# EAGLE design DOMINGO_FERMENTER_BOARD (EAGLE 9.7.0)
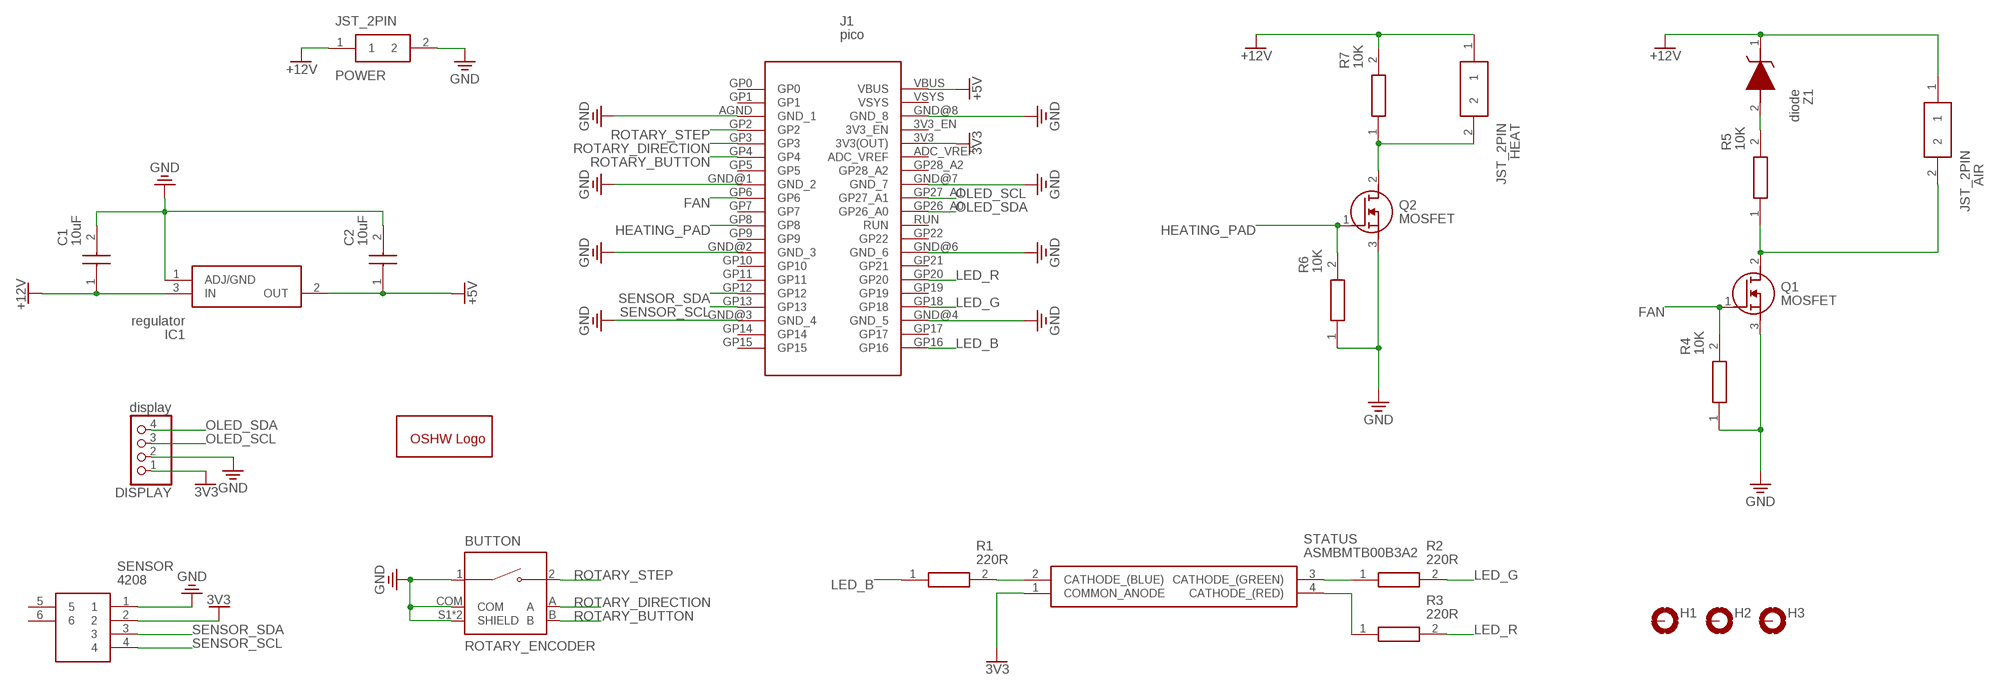
[diagram p0: schematic, sheet 1]

## Parts
AIR  JST_2PIN  [1769]
BUTTON  ROTARY_ENCODER  [XDCR_PEC11R-4215F-S0024]
C1  10uF  CAP_10UF  [CAPC2114X145N]
C2  10uF  CAP_10UF  [CAPC2114X145N]
DISPLAY  display  OLED_DISPLAY_1_3  [1X04-OLED_I2C]
GOLD_ORB_SM1  OSHWLOGOLOGO5MM  [OSHW_5MM]
H1  MOUNT-PAD-ROUND3.2  [3,2-PAD]
H2  MOUNT-PAD-ROUND3.2  [3,2-PAD]
H3  MOUNT-PAD-ROUND3.2  [3,2-PAD]
HEAT  JST_2PIN  [1769]
IC1  regulator  VOLT_REG  [LM317MADTRKG]
J1  pico  PICOPICO-TH-CLEAN  [RPI_PICO_TH]
POWER  JST_2PIN  [1769]
Q1  MOSFET  [FFSD0465A]
Q2  MOSFET  [FFSD0465A]
R1  220R  RES_1206  [RESC3116X65N]
R2  220R  RES_1206  [RESC3116X65N]
R3  220R  RES_1206  [RESC3116X65N]
R4  10K  RES_1206  [RESC3116X65N]
R5  10K  RES_1206  [RESC3116X65N]
R6  10K  RES_1206  [RESC3116X65N]
R7  10K  RES_1206  [RESC3116X65N]
SENSOR  4208  [4208]
STATUS  ASMBMTB00B3A2  LED_RGB  [ASMBMTB00B3A2]
Z1  diode  DIODE  [SOD3716X135N]

## Nets
3V3 [signal]: DISPLAY.1(VDD) J1.3V3(3V3(OUT)) SENSOR.2 STATUS.1(COMMON_ANODE)
+5V [POWER]: C2.1 IC1.2(OUT) J1.VBUS
+12V [POWER]: AIR.1 C1.1 HEAT.1 IC1.3(IN) POWER.1 R7.2 Z1.1(K)
FAN [POWER]: J1.GP6 Q1.1(G) R4.2
GND: BUTTON.1 BUTTON.COM BUTTON.S1(SHIELD) BUTTON.S2(SHIELD) C1.2 C2.2 DISPLAY.2(GND) IC1.1(ADJ/GND) J1.AGND(GND_1) J1.GND@1(GND_2) J1.GND@2(GND_3) J1.GND@3(GND_4) J1.GND@4(GND_5) J1.GND@6(GND_6) J1.GND@7(GND_7) J1.GND@8(GND_8) POWER.2 Q1.3(S) Q2.3(S) R4.1 R6.1 SENSOR.1
HEATING_PAD [POWER]: J1.GP8 Q2.1(G) R6.2
LED_B [signal]: J1.GP16 R1.1
LED_G [signal]: J1.GP18 R2.2
LED_R [signal]: J1.GP20 R3.2
N$1: HEAT.2 Q2.2(D) R7.1
N$2: R1.2 STATUS.2(CATHODE_(BLUE))
N$3: R2.1 STATUS.3(CATHODE_(GREEN))
N$4: R3.1 STATUS.4(CATHODE_(RED))
N$6: AIR.2 Q1.2(D) R5.1
N$7: R5.2 Z1.2(A)
OLED_SCL [signal]: DISPLAY.3(SCK) J1.GP27_A1
OLED_SDA [signal]: DISPLAY.4(SDA) J1.GP26_A0
ROTARY_BUTTON [signal]: BUTTON.B J1.GP4
ROTARY_DIRECTION [signal]: BUTTON.A J1.GP3
ROTARY_STEP [signal]: BUTTON.2 J1.GP2
SENSOR_SCL [signal]: J1.GP13 SENSOR.4
SENSOR_SDA [signal]: J1.GP12 SENSOR.3
Unconnected: H1.B3,2(MOUNT) H2.B3,2(MOUNT) H3.B3,2(MOUNT) J1.3V3_EN J1.ADC_VREF J1.GP0 J1.GP1 J1.GP5 J1.GP7 J1.GP9 J1.GP10 J1.GP11 J1.GP14 J1.GP15 J1.GP17 J1.GP19 J1.GP21 J1.GP22 J1.GP28_A2 J1.RUN J1.VSYS SENSOR.5 SENSOR.6

## Library data of the parts
AIR HEAT POWER = Library Fermenter Mini:JST_2PIN: Adafruit Accessories JST-PH 2-pin SMT Right Angle Connect Source: Datasheet <https://cdn-shop.adafruit.com/datasheets/17311.pdf>; ARROW_PART_NUMBER: 1769; ARROW_PRICE-STOCK: https://www.arrow.com/en/products/1769/adafruit-industries?region=nac; DESCRIPTION: Adafruit Accessories JST-PH 2-pin SMT Right Angle Connect; HEIGHT: mm; MANUFACTURER_NAME: Adafruit; MANUFACTURER_PART_NUMBER: 1769; MOUSER_PART_NUMBER: 485-1769; MOUSER_PRICE-STOCK: https://www.mouser.co.uk/ProductDetail/Adafruit/1769?qs=GURawfaeGuBbgoGtf2XstA%3D%3D
BUTTON = Library Fermenter Mini:ROTARY_ENCODER: Incremental Encoder, 12 Mm, Contact Rating 10 Ma - 5 Vdc Check availability <https://pricing.snapeda.com/parts/PEC11R-4215F-S0024/Bourns/view-part?ref=eda>; AVAILABILITY: In Stock; DESCRIPTION: Rotary Encoder Mechanical 24 Quadrature (Incremental) Vertical; MF: Bourns; MP: PEC11R-4215F-S0024; PACKAGE: None; PRICE: None; PURCHASE-URL: https://pricing.snapeda.com/search/part/PEC11R-4215F-S0024/?ref=eda
C1 C2 = Library Fermenter Mini:CAP_10UF: Multilayer Ceramic Capacitors MLCC - SMD/SMT 0805 10VDC 10uF 10% X7T AEC-Q200 Source: Datasheet <https://www.mouser.de/datasheet/2/396/TAIY_S_A0012830329_1-2514546.pdf>; DESCRIPTION: Multilayer Ceramic Capacitors MLCC - SMD/SMT 0805 10VDC 10uF 10% X7T AEC-Q200; HEIGHT: 1.45mm; MANUFACTURER_NAME: TAIYO YUDEN; MANUFACTURER_PART_NUMBER: LMR212BD7106KG-T; MOUSER_PART_NUMBER: 963-LMR212BD7106KG-T; MOUSER_PRICE-STOCK: https://www.mouser.co.uk/ProductDetail/Taiyo-Yuden/LMR212BD7106KG-T?qs=DRkmTr78QATXuUQGmCCYPQ%3D%3D
DISPLAY = OLED_display_1_3:OLED_DISPLAY_1_3
GOLD_ORB_SM1 = oshw:OSHWLOGO: The OSHW logo for PCB layout
H1-H3 = holes:MOUNT-PAD-ROUND: MOUNTING PAD, round
IC1 = Library Fermenter Mini:VOLT_REG: LDO Voltage Regulators 5.0V 1A Positive Source: Datasheet <https://componentsearchengine.com/Datasheets/2/NCP1117DT50G.pdf>; ARROW_PART_NUMBER: NCP1117DT50G; ARROW_PRICE-STOCK: https://www.arrow.com/en/products/ncp1117dt50g/on-semiconductor?region=europe; DESCRIPTION: LDO Voltage Regulators 5.0V 1A Positive; HEIGHT: 2.38mm; MANUFACTURER_NAME: ON Semiconductor; MANUFACTURER_PART_NUMBER: NCP1117DT50G; MOUSER_PART_NUMBER: 863-NCP1117DT50G; MOUSER_PRICE-STOCK: https://www.mouser.co.uk/ProductDetail/onsemi/NCP1117DT50G?qs=Gev%252BmEvV0iaXyZQB7E2Yhg%3D%3D
J1 = Library Fermenter Mini:PICO: RP2040 microcontroller chip designed by Raspberry Pi in the United Kingdom 2 SPI, 2 I2C, 2 UART, 3 12-bit ADC, 16 controllable PWM channels Source: Datasheet <https://datasheets.raspberrypi.org/pico/pico_datasheet.pdf>
Q1 Q2 = Library Fermenter Mini:MOSFET: N-Channel Logic Level Power MOSFET 50V, 16A, 47m Source: Datasheet <https://www.onsemi.com/pub/Collateral/RFD16N05LSM-D.PDF>; ARROW_PART_NUMBER: RFD16N05LSM9A; ARROW_PRICE-STOCK: https://www.arrow.com/en/products/rfd16n05lsm9a/on-semiconductor; DESCRIPTION: N-Channel Logic Level Power MOSFET 50V, 16A, 47m; HEIGHT: 2.39mm; MANUFACTURER_NAME: ON Semiconductor; MANUFACTURER_PART_NUMBER: RFD16N05LSM9A; MOUSER_PART_NUMBER: 512-RFD16N05LSM9A; MOUSER_PRICE-STOCK: https://www.mouser.com/Search/Refine.aspx?Keyword=512-RFD16N05LSM9A
R1-R7 = Library Fermenter Mini:RES_1206: SMD AEC-Q200 Compliant Thick Film Chip Resistor, Source: Datasheet <https://www.arrow.com/en/products/crgcq1206f10k/te-connectivity>; ARROW_PART_NUMBER: CRGCQ1206F10K; ARROW_PRICE-STOCK: https://www.arrow.com/en/products/crgcq1206f10k/te-connectivity; DESCRIPTION: SMD AEC-Q200 Compliant Thick Film Chip Resistor,; HEIGHT: 0.65mm; MANUFACTURER_NAME: TE Connectivity; MANUFACTURER_PART_NUMBER: CRGCQ1206F10K; MOUSER_PART_NUMBER: 279-CRGCQ1206F10K; MOUSER_PRICE-STOCK: https://www.mouser.co.uk/ProductDetail/TE-Connectivity-Holsworthy/CRGCQ1206F10K?qs=wUXugUrL1qyq3DLCZm2TIg%3D%3D
SENSOR = Library Fermenter Mini:4208: Adafruit Accessories JST SH 4-pin Right Angle Connector (10-pack) - Qwiic Compatible Source: Datasheet <https://cdn-shop.adafruit.com/product-files/4208/4208_Kaweei_C13396_diagram.pdf>; DESCRIPTION: Adafruit Accessories JST SH 4-pin Right Angle Connector (10-pack) - Qwiic Compatible; HEIGHT: 3.05mm; MANUFACTURER_NAME: Adafruit; MANUFACTURER_PART_NUMBER: 4208; MOUSER_PART_NUMBER: 485-4208; MOUSER_PRICE-STOCK: https://www.mouser.co.uk/ProductDetail/Adafruit/4208?qs=PzGy0jfpSMtbScLbr0L5dw%3D%3D
STATUS = Library Fermenter Mini:LED_RGB: Standard LEDs - SMD PLCC4,T/Mt,BS/WF Silicone RGB Source: Datasheet <https://docs.broadcom.com/doc/AV02-4186EN>; DESCRIPTION: Standard LEDs - SMD PLCC4,T/Mt,BS/WF Silicone RGB; HEIGHT: 2.1mm; MANUFACTURER_NAME: Avago Technologies; MANUFACTURER_PART_NUMBER: ASMB-MTB0-0B3A2; MOUSER_PART_NUMBER: 630-ASMB-MTB0-0B3A2; MOUSER_PRICE-STOCK: https://www.mouser.co.uk/ProductDetail/Broadcom-Avago/ASMB-MTB0-0B3A2?qs=pUKx8fyJudDHauriy4v3sw%3D%3D
Z1 = Library Fermenter Mini:DIODE: Zener Diodes ZEN REG 0.5W 30V Source: Datasheet <https://componentsearchengine.com/Datasheets/2/SZMMSZ4713T1G.pdf>; ARROW_PART_NUMBER: SZMMSZ4713T1G; ARROW_PRICE-STOCK: https://www.arrow.com/en/products/szmmsz4713t1g/on-semiconductor?region=nac; DESCRIPTION: Zener Diodes ZEN REG 0.5W 30V; HEIGHT: 1.35mm; MANUFACTURER_NAME: ON Semiconductor; MANUFACTURER_PART_NUMBER: SZMMSZ4713T1G; MOUSER_PART_NUMBER: 863-SZMMSZ4713T1G; MOUSER_PRICE-STOCK: https://www.mouser.co.uk/ProductDetail/onsemi/SZMMSZ4713T1G?qs=PJJcWtbOkNU%2F%252BcrJAwZPrw%3D%3D

## Net classes
1 POWER: width 0.762 mm, clearance 0.127 mm
2 signal: width 0.254 mm, clearance 0.127 mm

## Board
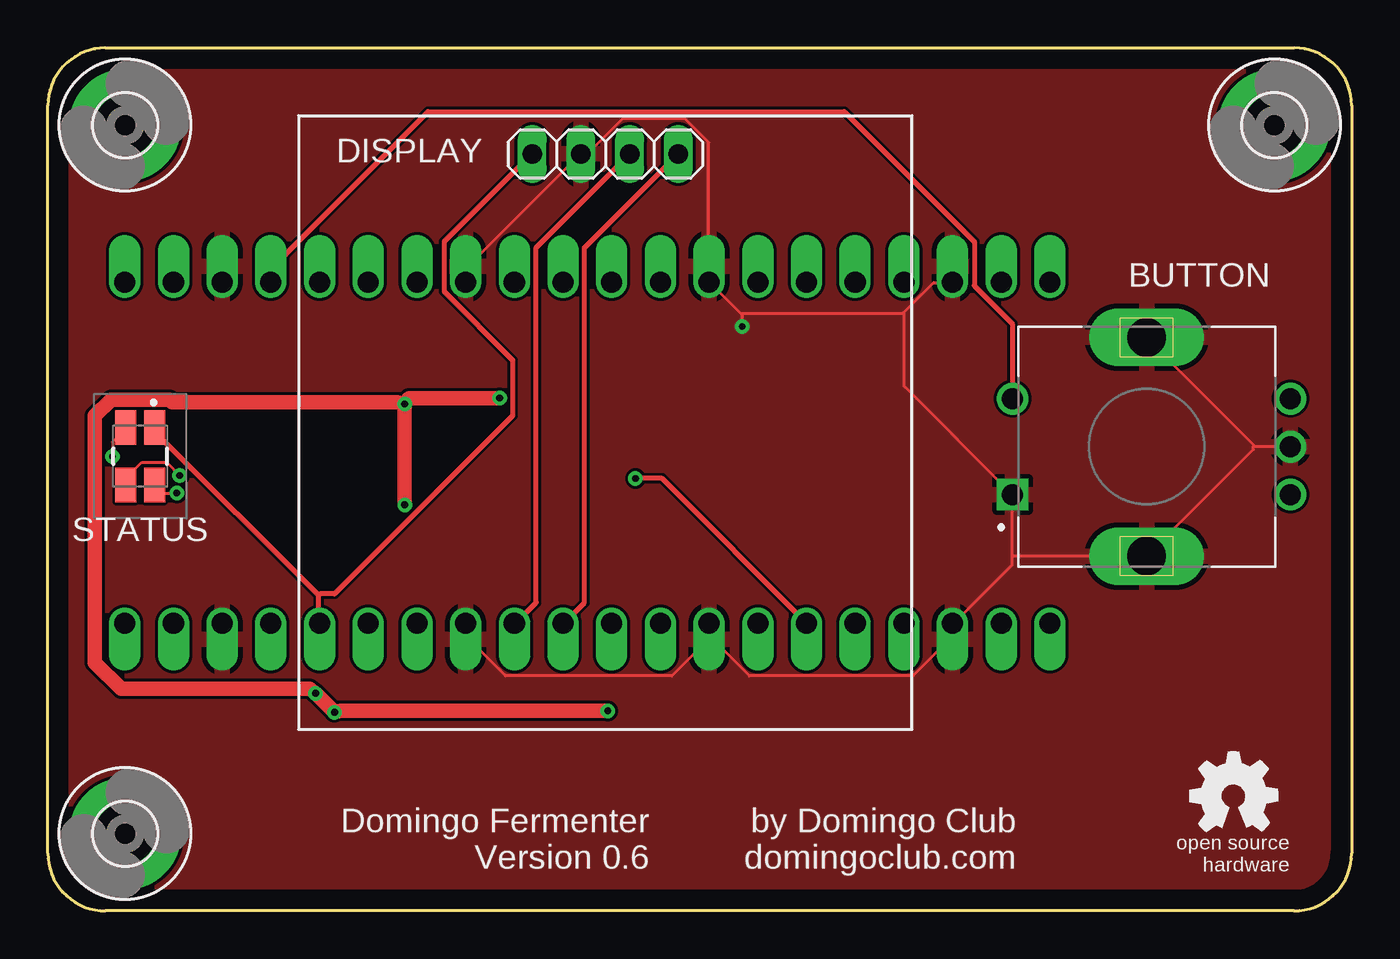
[diagram p1: board, top side]
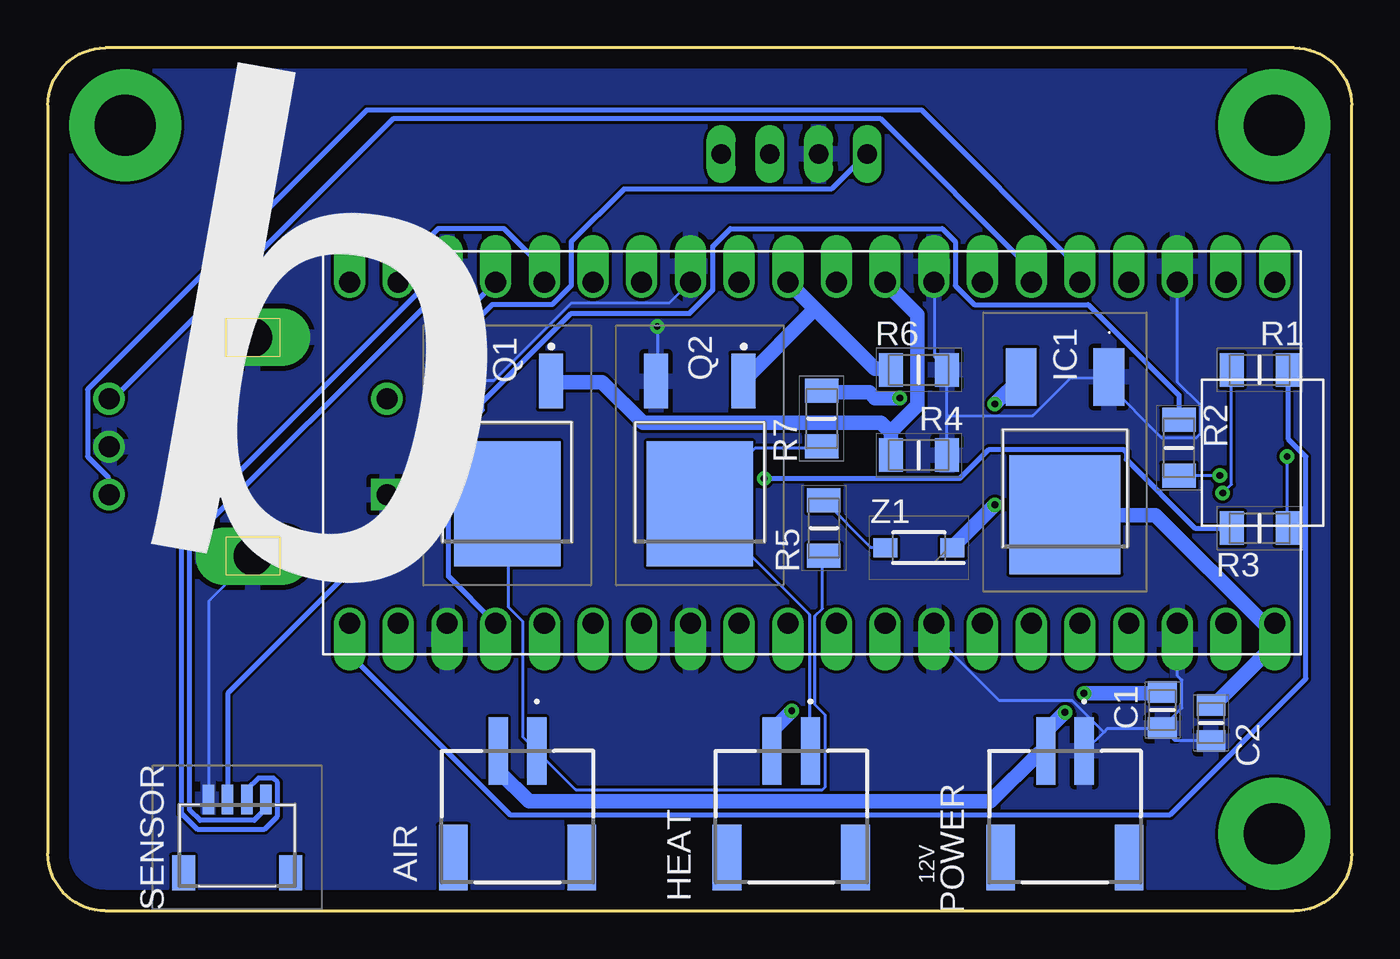
[diagram p2: board, bottom side, seen from below]

Size 68 x 45 mm. Coordinates in mm from the lower left corner, seen from the top.
Outline: 65,0 arc90 68,3 68,42 arc90 65,45 3,45 arc90 0,42 0,3 arc90 3,0 65,0
Copper layers (1*16): Top / Bottom
Stack-up Default Layer Stack: Top User Defined 0.035mm / Dielectric-1 User Defined 1.5mm / Bottom User Defined 0.035mm
Design rules "default": minimum track width 6mil, minimum drill 0.35mm, track to track 6mil, track to pad 6mil, pad to pad 6mil, via to via 6mil, smd to smd 6mil, copper to edge 40mil, drill to drill 6mil, minimum pad ring 10mil, minimum via ring 8mil, stop-mask expansion 4mil, vias tented up to drill 0mil, thermal gap 10mil

### Footprints (pad centres in the part's own frame; a part is rotated, then mirrored left to right if it is on the bottom)
1769 = smd 1 x 3.5: 1 -1,0; 2 1,0 | smd 1.5 x 3.4: 3 -3.35,-5.55; 4 3.35,-5.55
XDCR_PEC11R-4215F-S0024 = drill 1.1 square: 1 -2.5,7 | drill 1.1: 2 2.5,7; A -2.5,-7.5; B 2.5,-7.5; COM 0,-7.5 | drill 2 long: S1 -5.7,0; S2 5.7,0
CAPC2114X145N = smd 1.1 x 1.49: 1 -0.94,0; 2 0.94,0
1X04-OLED_I2C = drill 1.016 long: 1 -3.81,0; 2 -1.27,0; 3 1.27,0; 4 3.81,0
3,2-PAD = drill 3.2 pad 5.842: B3,2 0,0
LM317MADTRKG = smd 3 x 1.6: 1 4.08,-2.285; 3 4.08,2.285 | smd 6.2 x 5.8: 2 -3.1,0
RPI_PICO_TH = drill 1.1 pad 1.6 offset: 3V3 8.89,13.97; 3V3_EN 8.89,16.51; ADC_VREF 8.89,11.43; AGND 8.89,6.35; GND@1 -8.89,19.05; GND@2 -8.89,6.35; GND@3 -8.89,-6.35; GND@4 -8.89,-19.05; GND@6 8.89,-19.05; GND@7 8.89,-6.35; GND@8 8.89,19.05; GP0 -8.89,24.13; GP1 -8.89,21.59; GP2 -8.89,16.51; GP3 -8.89,13.97; GP4 -8.89,11.43; GP5 -8.89,8.89; GP6 -8.89,3.81; GP7 -8.89,1.27; GP8 -8.89,-1.27; GP9 -8.89,-3.81; GP10 -8.89,-8.89; GP11 -8.89,-11.43; GP12 -8.89,-13.97; GP13 -8.89,-16.51; GP14 -8.89,-21.59; GP15 -8.89,-24.13; GP16 8.89,-24.13; GP17 8.89,-21.59; GP18 8.89,-16.51; GP19 8.89,-13.97; GP20 8.89,-11.43; GP21 8.89,-8.89; GP22 8.89,-3.81; GP26_A0 8.89,1.27; GP27_A1 8.89,3.81; GP28_A2 8.89,8.89; RUN 8.89,-1.27; VBUS 8.89,24.13; VSYS 8.89,21.59
FFSD0465A = smd 1.25 x 2.85: 1 -2.28,-6.4; 3 2.28,-6.4 | smd 5.55 x 6.5: 2 0,0
RESC3116X65N = smd 1.25 x 1.75: 1 -1.45,0; 2 1.45,0
4208 = smd 0.6 x 1.55: 1 -1.5,1.975; 2 -0.5,1.975; 3 0.5,1.975; 4 1.5,1.975 | smd 1.2 x 1.8: 5 -2.8,-1.85; 6 2.8,-1.85
ASMBMTB00B3A2 = smd 1.1 x 1.8: 1 -0.75,-1.5; 2 -0.75,1.5; 3 0.75,1.5; 4 0.75,-1.5
SOD3716X135N = smd 1.25 x 1: 1 -1.75,0; 2 1.75,0

### Placement (x,y rotation side)
AIR  43.5,8.34 0 bottom
BUTTON  57.31,24.21 90 top
C1  9.87,10.48 270 bottom
C2  7.33,9.8 270 bottom
DISPLAY  29.07,39.47 0 top
GOLD_ORB_SM1  61.84,5.99 0 top
H1  4.03,40.97 180 top
H2  4.03,4.03 180 top
H3  63.97,40.97 180 top
HEAT  29.23,8.34 0 bottom
IC1  14.95,23.77 90 bottom
J1  28.14,23.89 270 bottom
POWER  14.95,8.34 0 bottom
Q1  44.04,21.23 180 bottom
Q2  34,21.23 180 bottom
R1  4.79,28.21 180 bottom
R2  9,24.15 90 bottom
R3  4.79,19.96 180 bottom
R4  22.57,23.77 180 bottom
R5  27.53,19.96 90 bottom
R6  22.57,28.21 180 bottom
R7  27.64,25.67 90 bottom
SENSOR  58.13,3.84 0 bottom
STATUS  4.82,23.72 180 top
Z1  22.57,18.94 180 bottom

### Tracks (layer width: path | path; a pad name or v marks a point on that pad's centre or on a via)
3V3
  Top 0.254: 14.11,16.46 5.58,24.99 5.58,25.14 STATUS.1 | 14.11,16.46 14.11,15.01 J1.3V3 | 14.11,16.46 14.19,16.53 14.95,16.53 24.25,25.83 24.25,28.72 20.66,32.3 20.66,34.9 25.24,39.47 DISPLAY.1
  Bottom 0.254: SENSOR.2 58.61,5.86 58.61,11.35 47.56,22.4 47.56,28.88 44.82,31.62 41.7,31.62 40.71,32.61 40.71,34.9 37.96,37.64 27.14,37.64 25.31,39.47 DISPLAY.1
+5V
  Bottom 0.762: C2.1 7.33,10.82 7.1,10.82 4.05,13.86 4.05,14.93 J1.VBUS 4.43,15.01 4.59,15.01 10.23,20.65 14.95,20.65 IC1.2
+12V  (via drill 0.35)
  Top 0.762: v18.61,26.44 v18.61,21.18 | v23.56,26.74 18.84,26.74 v18.61,26.44 | v29.2,10.44 15.26,10.44 v14.95,10.36 v13.96,11.35 13.66,11.58 3.83,11.58 2.45,12.95 2.45,25.83 3.29,26.67 6.34,26.67 6.49,26.51 18.23,26.51 v18.61,26.44
  Bottom 0.762: v18.61,21.18 20.82,18.97 Z1.1 | v18.61,26.44 17.24,27.81 IC1.3 | v23.56,26.74 24.86,26.74 25.16,27.05 27.6,27.05 R7.2 | v13.96,11.35 9.92,11.35 C1.1 | v14.95,10.36 15.94,9.37 15.94,8.38 POWER.1 16.32,8.23 18.84,5.71 42.91,5.71 44.44,7.24 44.44,8.3 AIR.1 | v29.2,10.44 30.19,9.44 30.19,8.38 HEAT.1
FAN
  Bottom 0.762: 24.02,24.99 R4.2 | 24.02,24.99 22.65,26.36 22.65,31.09 24.32,32.76 J1.GP6 | Q1.1 41.7,27.58 39.11,27.58 36.97,25.45 24.55,25.45 24.32,25.22 24.02,24.99
GND  (via drill 0.35)
  Top 0.152: 62.92,24.27 57.32,29.87 BUTTON.S2 | 62.92,24.27 62.96,24.23 64.78,24.23 BUTTON.COM | 62.92,24.27 62.88,24.23 62.88,24.08 BUTTON.S1 57.24,18.51 50.31,18.51 | J1.GND@2 21.81,32.84 21.81,33.52 27.75,39.47 DISPLAY.2 27.83,39.54 28.21,39.54 29.96,41.3 33.24,41.3 34.46,40.08 34.46,32.84 J1.GND@3 34.53,32.76 36.17,31.12 | v36.21,30.48 36.21,31.09 36.17,31.12 | 44.63,31.2 44.59,31.16 36.21,31.16 36.17,31.12 | 44.63,31.2 46.19,32.76 47.18,32.76 J1.GND@4 | 50.31,18.51 50.31,18.05 47.26,15.01 J1.GND@6 47.18,14.93 47.18,14.32 45.12,12.26 36.59,12.26 34.53,14.32 34.53,14.93 J1.GND@7 34.53,14.25 32.55,12.26 23.87,12.26 21.81,14.32 21.81,14.93 J1.AGND | 50.31,18.51 50.31,21.64 BUTTON.1 44.67,27.35 44.67,31.16 44.63,31.2
  Bottom 0.152: SENSOR.1 59.6,5.86 59.6,16.15 57.32,18.44 BUTTON.S1 | 21.12,25.83 21.12,28.19 R6.1 21.12,28.27 21.73,28.88 21.73,32.76 J1.GND@2 | 21.12,25.83 R4.1 | 21.12,25.83 16.63,25.83 14.65,27.81 12.74,27.81 IC1.1 12.74,27.73 12.74,27.5 9.92,24.68 8.09,24.68 7.86,24.91 7.86,26.36 9.08,27.58 9.08,32.76 J1.GND@1 | C2.2 7.33,8.91 9.24,8.91 9.85,9.52 C1.2 | 12.93,9.33 13.88,8.38 POWER.2 | 12.93,9.33 12.74,9.52 9.92,9.52 C1.2 | J1.GND@8 9.08,14.93 9.08,12.26 8.85,12.04 8.85,10.59 9.85,9.6 C1.2 | 12.93,9.33 14.57,10.97 18.38,10.97 21.73,14.32 21.73,14.93 J1.AGND | v36.21,30.48 36.21,27.66 Q2.3 | Q1.3 46.27,27.66 44.74,27.66 40.71,31.7 35.6,31.7 34.53,32.76 J1.GND@3
  pour Top: 3,0 arc-90 0,3 0,42 arc-90 3,45 65,45 arc-90 68,42 68,3 arc-90 65,0
  pour Bottom: 75.91,0.91 75.91,42.82 67.02,51.71 -2.83,51.71 -4.1,50.44 -4.1,-5.44 69.56,-5.44
HEATING_PAD
  Bottom 0.762: 27.98,31.39 29.35,32.76 J1.GP8 | 27.98,31.39 24.86,28.27 24.09,28.27 R6.2 | 27.98,31.39 31.71,27.66 Q2.1
LED_B
  Bottom 0.254: R1.1 3.29,28.19 3.29,24.61 2.38,23.69 2.38,12.11 9.46,5.03 43.91,5.03 52.21,13.33 52.21,14.93 J1.GP16
LED_G
  Bottom 0.254: R2.2 9.01,25.68 9.01,26.89 13.73,31.62 19.67,31.62 20.66,32.61 20.66,34.9 21.35,35.58 32.4,35.58 33.31,34.67 33.31,32.38 34.53,31.16 40.71,31.16 45.35,26.51 45.35,26.13 46.73,24.76 46.95,24.76 47.11,24.61 47.11,17.45 44.67,15.01 J1.GP18
LED_R  (via drill 0.35)
  Top 0.254: v30.65,22.55 32.02,22.55 J1.GP20
  Bottom 0.254: R3.2 8.17,19.96 11.75,23.54 11.75,23.92 11.9,24.08 18.91,24.08 20.44,22.55 v30.65,22.55
N$1
  Bottom 0.152: R7.1 27.68,24.15 31.1,24.15 34,21.26 Q2.2 34,21.18 28.29,15.46 28.29,8.38 HEAT.2
N$2  (via drill 0.35)
  Top 0.152: v6.72,21.79 5.96,21.79 5.58,22.17 STATUS.2
  Bottom 0.152: v6.72,21.79 6.26,22.25 6.26,28.19 R1.2
N$3  (via drill 0.35)
  Top 0.152: v6.87,22.7 6.19,23.39 4.89,23.39 4.13,22.63 4.13,22.25 STATUS.3
  Bottom 0.152: v6.87,22.7 8.93,22.7 R2.1
N$4  (via drill 0.35)
  Top 0.152: v3.37,23.69 3.37,24.46 4.05,25.14 STATUS.4
  Bottom 0.152: v3.37,23.69 3.37,19.96 R3.1
N$6
  Bottom 0.152: R5.1 27.6,18.44 27.6,15.77 27.98,15.39 27.98,10.74 27.45,10.21 27.45,6.47 27.6,6.32 40.48,6.32 42.46,8.3 AIR.2 42.53,8.38 43.22,9.06 43.22,15.08 43.98,15.85 43.98,21.18 Q1.2
N$7
  Bottom 0.152: Z1.2 24.32,18.97 25.09,18.97 R5.2
OLED_SCL
  Top 0.254: DISPLAY.3 25.47,34.59 25.47,16.07 24.4,15.01 J1.GP27_A1
OLED_SDA
  Top 0.254: DISPLAY.4 32.86,39.47 27.98,34.59 27.98,16.07 26.91,15.01 J1.GP26_A0
ROTARY_BUTTON
  Bottom 0.254: BUTTON.B 64.78,26.74 64.56,26.74 50,41.3 24.55,41.3 16.78,33.52 16.78,32.84 J1.GP4
ROTARY_DIRECTION
  Bottom 0.254: BUTTON.A 64.86,21.71 64.86,22.63 65.93,23.69 65.93,27.2 51.37,41.75 22.42,41.75 14.19,33.52 14.19,32.84 J1.GP3
ROTARY_STEP
  Top 0.254: BUTTON.2 50.31,26.74 50.31,30.63 48.33,32.61 48.33,34.9 41.54,41.68 19.83,41.68 11.67,33.52 11.67,32.84 J1.GP2
SENSOR_SCL
  Bottom 0.254: SENSOR.4 56.63,5.79 56.63,5.33 57.24,4.72 60.06,4.72 60.59,5.25 60.59,19.27 48.25,31.62 45.81,31.62 44.67,32.76 J1.GP13
SENSOR_SDA
  Bottom 0.254: SENSOR.3 57.62,5.86 57.62,6.32 57.01,6.93 56.25,6.93 56.02,6.7 56.02,4.95 56.71,4.26 60.21,4.26 61.05,5.1 61.05,19.88 48.33,32.61 48.33,34.9 47.64,35.58 44.21,35.58 42.15,33.52 42.15,32.84 J1.GP12

### Text on the board
tNames: Domingo Fermenter / Version 0.6 | by Domingo Club / domingoclub.com
bNames: d | 12V